# EAGLE design flint_v0.0.1 (EAGLE 7.3.0)
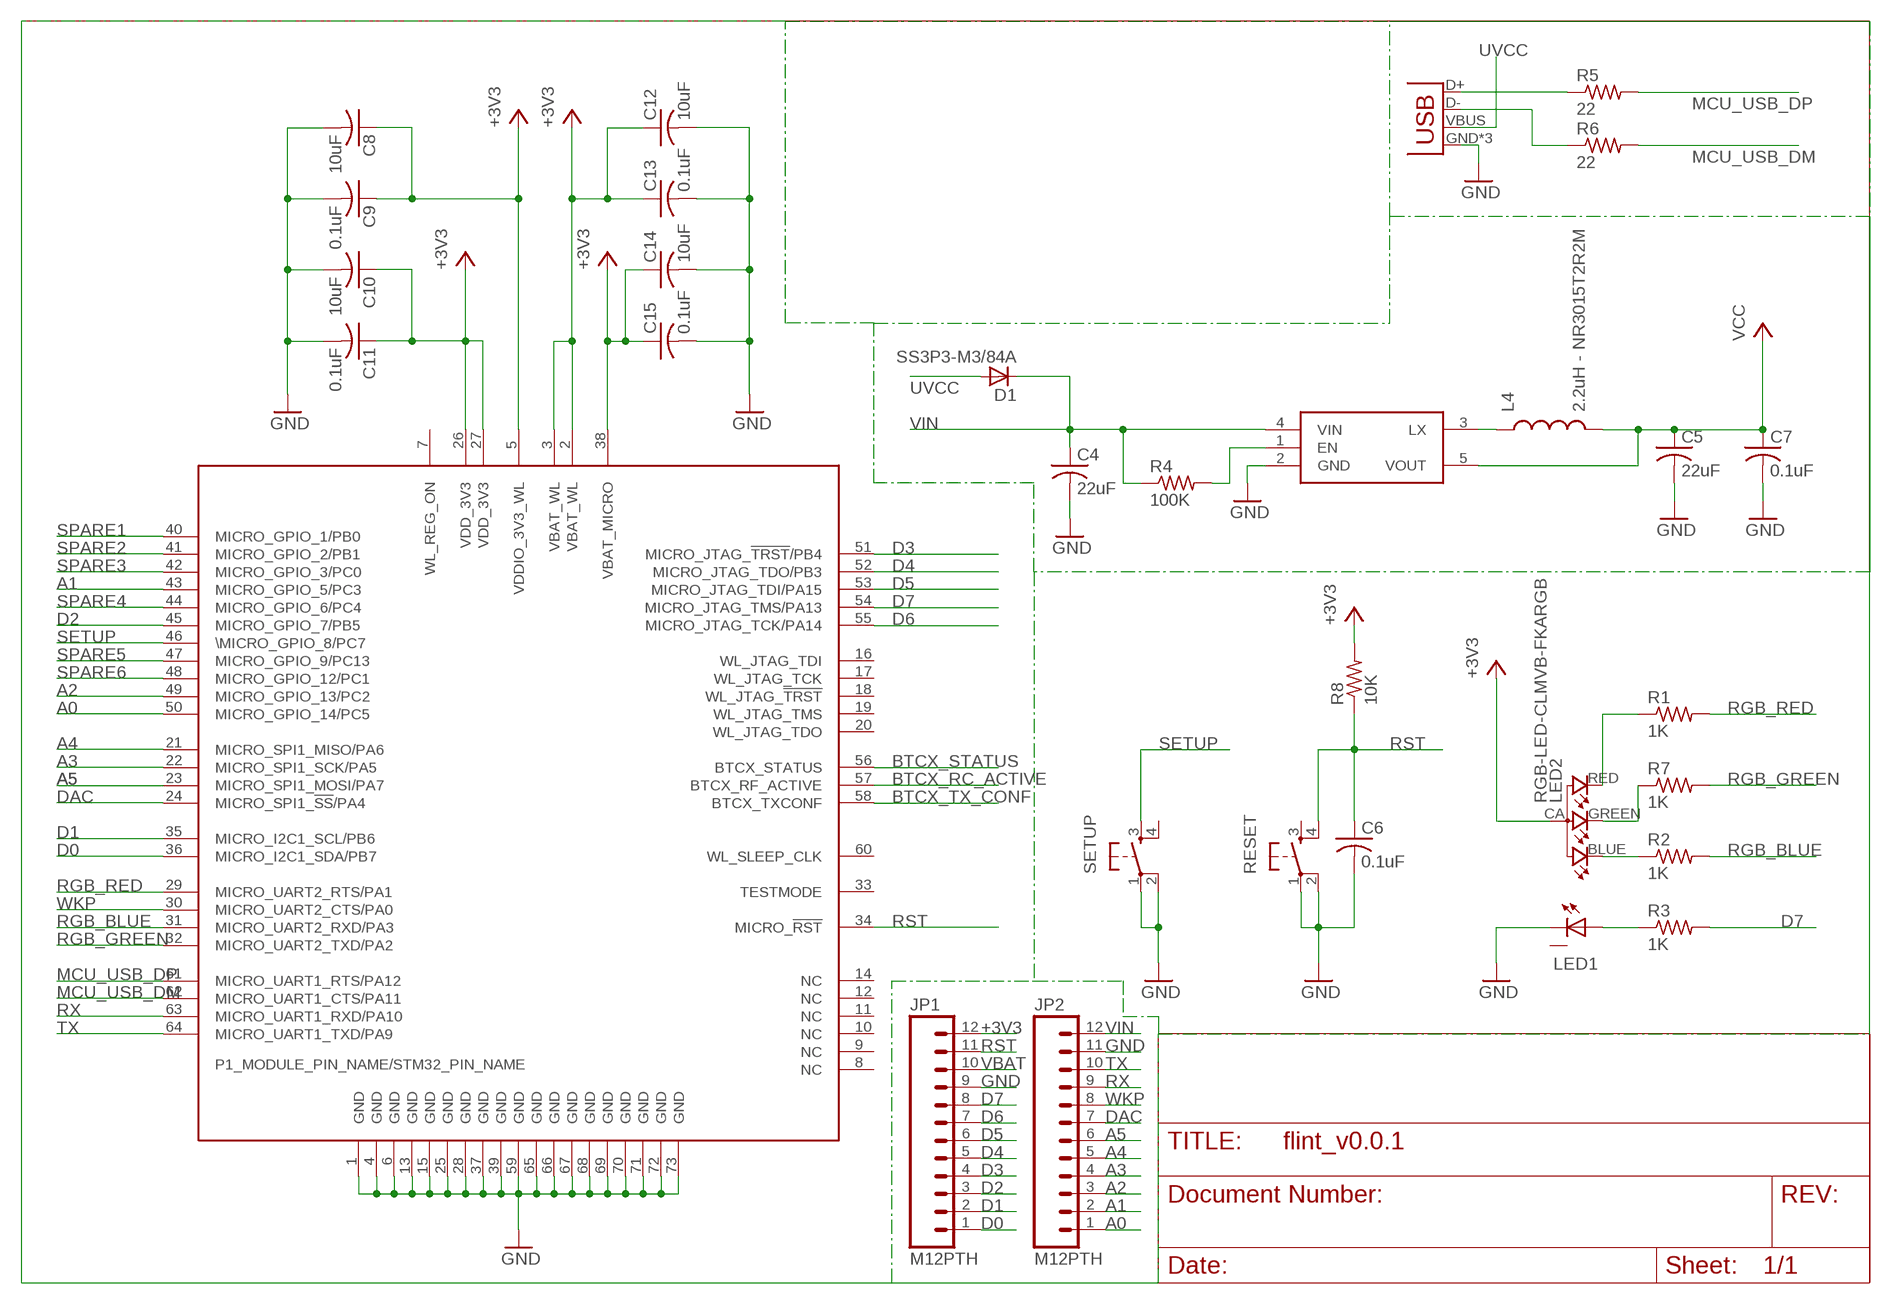
[diagram p0: schematic, sheet 1]

## Parts
C4  22uF  C-US  [C0402_B]
C5  22uF  C-US  [C0402_B]
C6  0.1uF  C-US  [C0402_B]
C7  0.1uF  C-US  [C0402_B]
C8  10uF  C-US  [C0402_B]
C9  0.1uF  C-US  [C0402_B]
C10  10uF  C-US  [C0402_B]
C11  0.1uF  C-US  [C0402_B]
C12  10uF  C-US  [C0402_B]
C13  0.1uF  C-US  [C0402_B]
C14  10uF  C-US  [C0402_B]
C15  0.1uF  C-US  [C0402_B]
D1  SS3P3-M3/84A  BYS10  [SOD106A]
JP1  M12PTH  [1X12-SMALL-PADS]
JP2  M12PTH  [1X12-SMALL-PADS]
JP4  USBUSB-MICROB-SMT-DIP  [USB-MICROB-SMT-DIP]
L4  2.2uH - NR3015T2R2M  INDUCTORB  [INDUCTOR-NR3015]
LED1  BLUE  XLAMP-XPE-THERMAL  [CREE_XLAMP]
LED2  RGB-LED-CLMVB-FKARGB  [PLCC4-2MM-RGB]
R1  1K  R-US_  [R0402_B]
R2  1K  R-US_  [R0402_B]
R3  1K  R-US_  [R0402_B]
R4  100K  R-US_  [R0402_B]
R5  22  R-US_  [R0402_B]
R6  22  R-US_  [R0402_B]
R7  1K  R-US_  [R0402_B]
R8  10K  R-US_  [R0402_B]
RESET  TAC_SWITCHSMD  [TACTILE_SWITCH_SMD]
SETUP  TAC_SWITCHSMD  [TACTILE_SWITCH_SMD]
U$1  WM-N-BM-14  [WM-N-BM-14]
U$2  R8008-33  [SOT23-5]

## Nets
+3V3: C5.1 C7.1 C8.1 C9.1 C10.1 C11.1 C12.1 C13.1 C14.1 C15.1 JP1.12 L4.2 LED2.CA R8.2 U$1.2(VBAT_WL) U$1.3(VBAT_WL) U$1.5(VDDIO_3V3_WL) U$1.26(VDD_3V3) U$1.27(VDD_3V3) U$1.38(VBAT_MICRO) U$2.5(VOUT) ; supply symbol labelled VCC
A0: JP2.1 U$1.50(MICRO_GPIO_14/PC5)
A1: JP2.2 U$1.43(MICRO_GPIO_5/PC3)
A2: JP2.3 U$1.49(MICRO_GPIO_13/PC2)
A3: JP2.4 U$1.22(MICRO_SPI1_SCK/PA5)
A4: JP2.5 U$1.21(MICRO_SPI1_MISO/PA6)
A5: JP2.6 U$1.23(MICRO_SPI1_MOSI/PA7)
BTCX_RC_ACTIVE: U$1.57(BTCX_RF_ACTIVE)
BTCX_STATUS: U$1.56(BTCX_STATUS)
BTCX_TX_CONF: U$1.58(BTCX_TXCONF)
D0: JP1.1 U$1.36(MICRO_I2C1_SDA/PB7)
D1: JP1.2 U$1.35(MICRO_I2C1_SCL/PB6)
D2: JP1.3 U$1.45(MICRO_GPIO_7/PB5)
D3: JP1.4 U$1.51(MICRO_JTAG_!TRST!/PB4)
D4: JP1.5 U$1.52(MICRO_JTAG_TDO/PB3)
D5: JP1.6 U$1.53(MICRO_JTAG_TDI/PA15)
D6: JP1.7 U$1.55(MICRO_JTAG_TCK/PA14)
D7: JP1.8 R3.2 U$1.54(MICRO_JTAG_TMS/PA13)
DAC: JP2.7 U$1.24(MICRO_SPI1_!SS!/PA4)
GND: C4.2 C5.2 C6.2 C7.2 C8.2 C9.2 C10.2 C11.2 C12.2 C13.2 C14.2 C15.2 JP1.9 JP2.11 JP4.GND JP4.MT1(GND) JP4.MT2(GND) LED1.C LED1.C@1(C) RESET.1 RESET.2 SETUP.1 SETUP.2 U$1.1(GND) U$1.4(GND) U$1.6(GND) U$1.13(GND) U$1.15(GND) U$1.25(GND) U$1.28(GND) U$1.37(GND) U$1.39(GND) U$1.59(GND) U$1.65(GND) U$1.66(GND) U$1.67(GND) U$1.68(GND) U$1.69(GND) U$1.70(GND) U$1.71(GND) U$1.72(GND) U$1.73(GND) U$2.2(GND)
MCU_USB_DM: R6.2 U$1.62(MICRO_UART1_CTS/PA11)
MCU_USB_DP: R5.2 U$1.61(MICRO_UART1_RTS/PA12)
N$1: JP4.D+ R5.1
N$3: JP4.D- R6.1
N$5: R4.2 U$2.1(EN)
N$6: LED2.BLUE R2.1
N$7: L4.1 U$2.3(LX)
N$8: LED2.RED R1.1
N$10: LED2.GREEN R7.1
N$11: LED1.A LED1.A@1(A) R3.1
RGB_BLUE: R2.2 U$1.31(MICRO_UART2_RXD/PA3)
RGB_GREEN: R7.2 U$1.32(MICRO_UART2_TXD/PA2)
RGB_RED: R1.2 U$1.29(MICRO_UART2_RTS/PA1)
RST: C6.1 JP1.11 R8.1 RESET.4 U$1.34(MICRO_!RST!)
RX: JP2.9 U$1.63(MICRO_UART1_RXD/PA10)
SETUP: SETUP.3 U$1.46(\MICRO_GPIO_8/PC7)
SPARE1: U$1.40(MICRO_GPIO_1/PB0)
SPARE2: U$1.41(MICRO_GPIO_2/PB1)
SPARE3: U$1.42(MICRO_GPIO_3/PC0)
SPARE4: U$1.44(MICRO_GPIO_6/PC4)
SPARE5: U$1.47(MICRO_GPIO_9/PC13)
SPARE6: U$1.48(MICRO_GPIO_12/PC1)
TX: JP2.10 U$1.64(MICRO_UART1_TXD/PA9)
UVCC: D1.A JP4.VBUS
VBAT: JP1.10
VIN: C4.1 D1.K JP2.12 R4.1 U$2.4(VIN)
WKP: JP2.8 U$1.30(MICRO_UART2_CTS/PA0)
Unconnected: LED1.X(T) RESET.3 SETUP.4 U$1.7(WL_REG_ON) U$1.8(NC) U$1.9(NC) U$1.10(NC) U$1.11(NC) U$1.12(NC) U$1.14(NC) U$1.16(WL_JTAG_TDI) U$1.17(WL_JTAG_TCK) U$1.18(WL_JTAG_!TRST!) U$1.19(WL_JTAG_TMS) U$1.20(WL_JTAG_TDO) U$1.33(TESTMODE) U$1.60(WL_SLEEP_CLK)

## Library data of the parts
C4-C15 = Spark:C-US: Capacitor
D1 = telefunken:BYS10: DIODE; MPN: BYS10/45; OC_FARNELL: 9549188; OC_NEWARK: 96K7236
JP1 JP2 = Spark:M12: Header 12 Standard 12-pin 0.1" header. Use with straight break away headers (SKU : PRT-00116), right angle break away headers (PRT-00553), swiss pins (PRT-00743), machine pins (PRT-00117), and female headers (PRT-00115).
JP4 = Spark:USB
L4 = Spark:INDUCTOR
LED1 = Spark:XLAMP-XPE-THERMAL
LED2 = Spark:RGB-LED-CLMVB-FKA: CREE CLMVB-FKA RGB LED 2mm x 2mm
R1-R8 = Spark:R-US_: 0402 Resistor
RESET SETUP = Spark:TAC_SWITCH: SMD Tactiile Switch
U$1 = Spark:WM-N-BM-14
U$2 = Spark:R8008-33

## Board
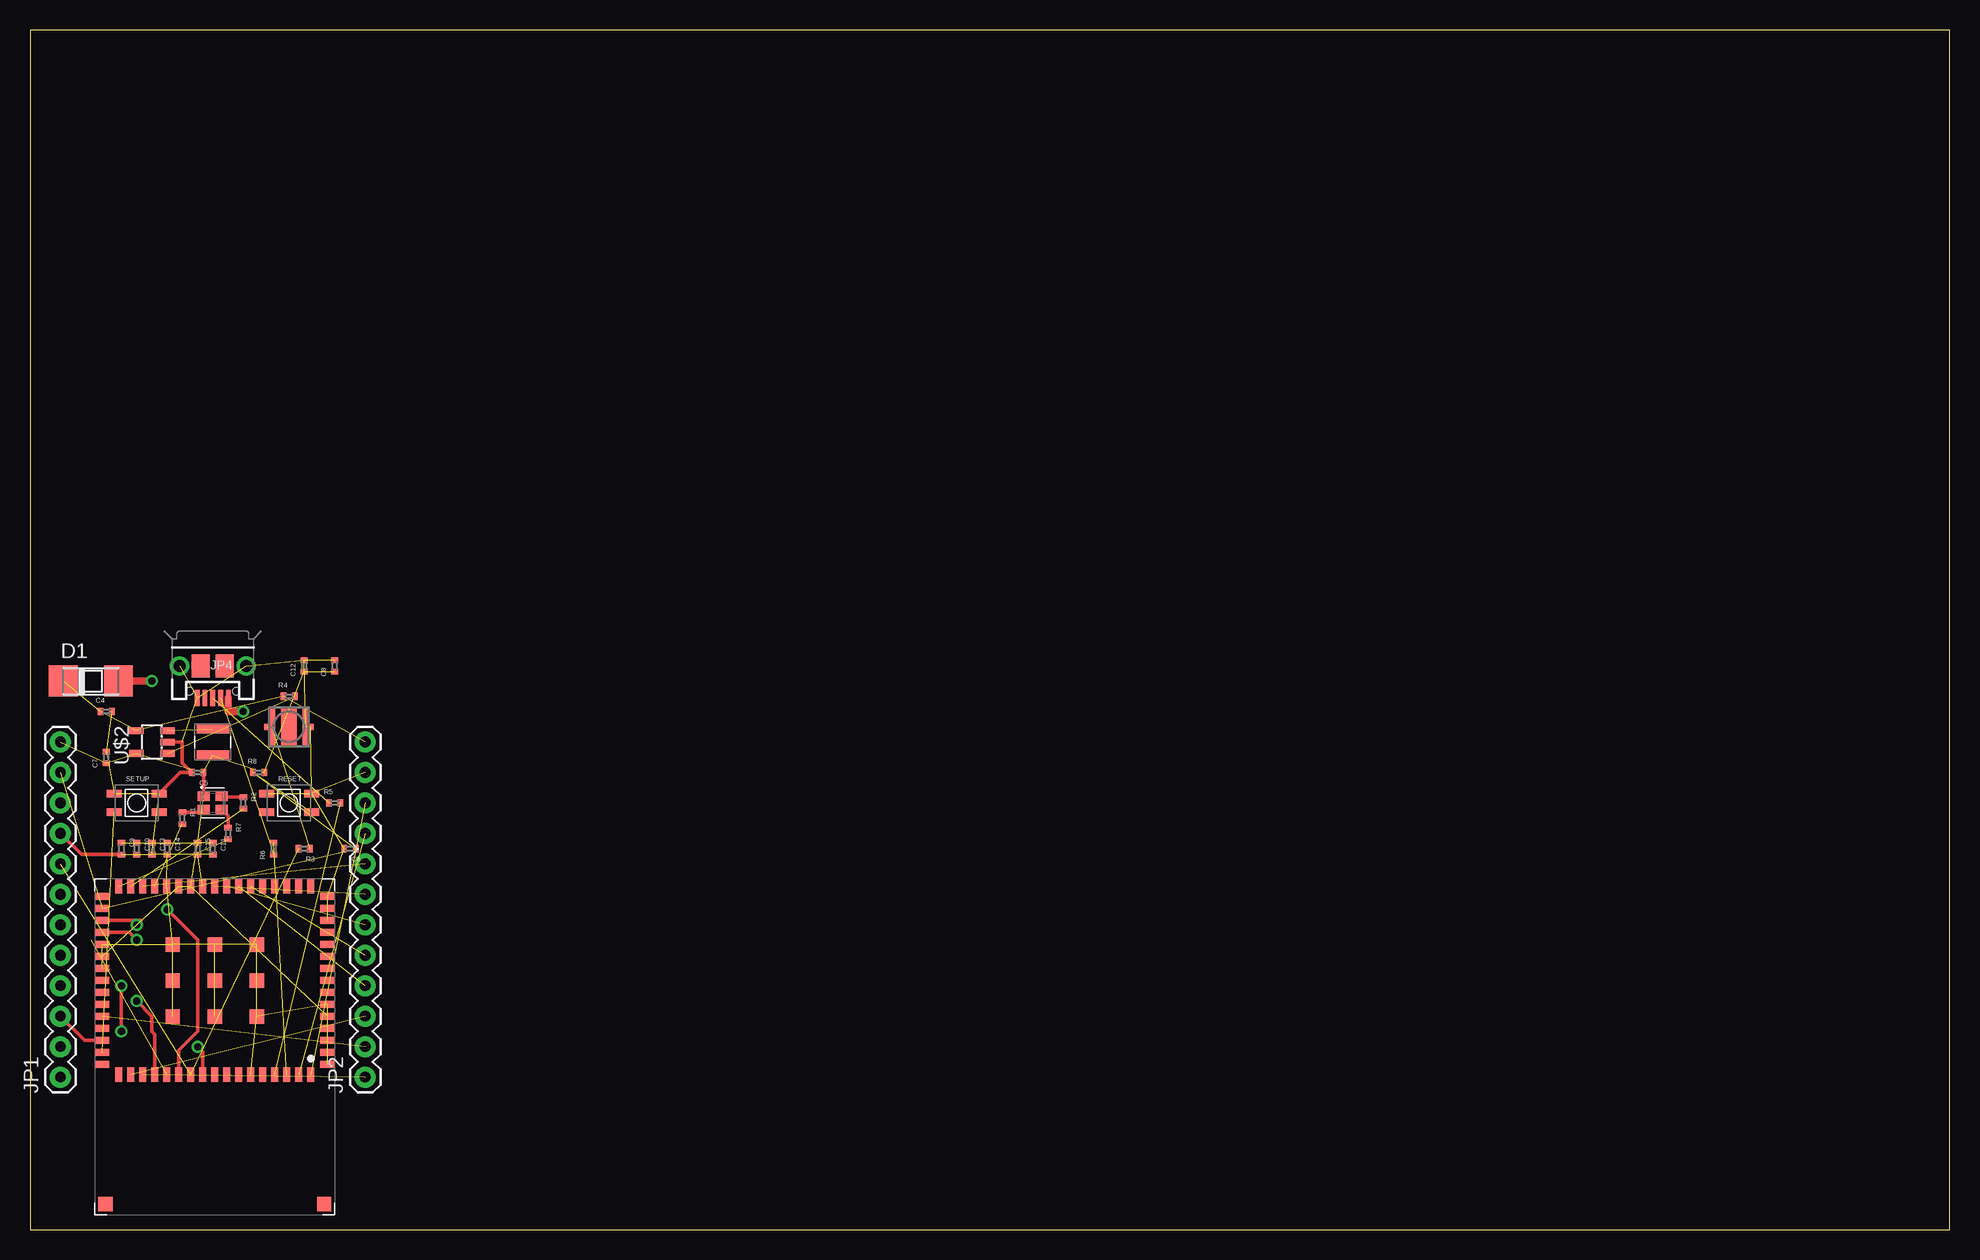
[diagram p1: board, top side]
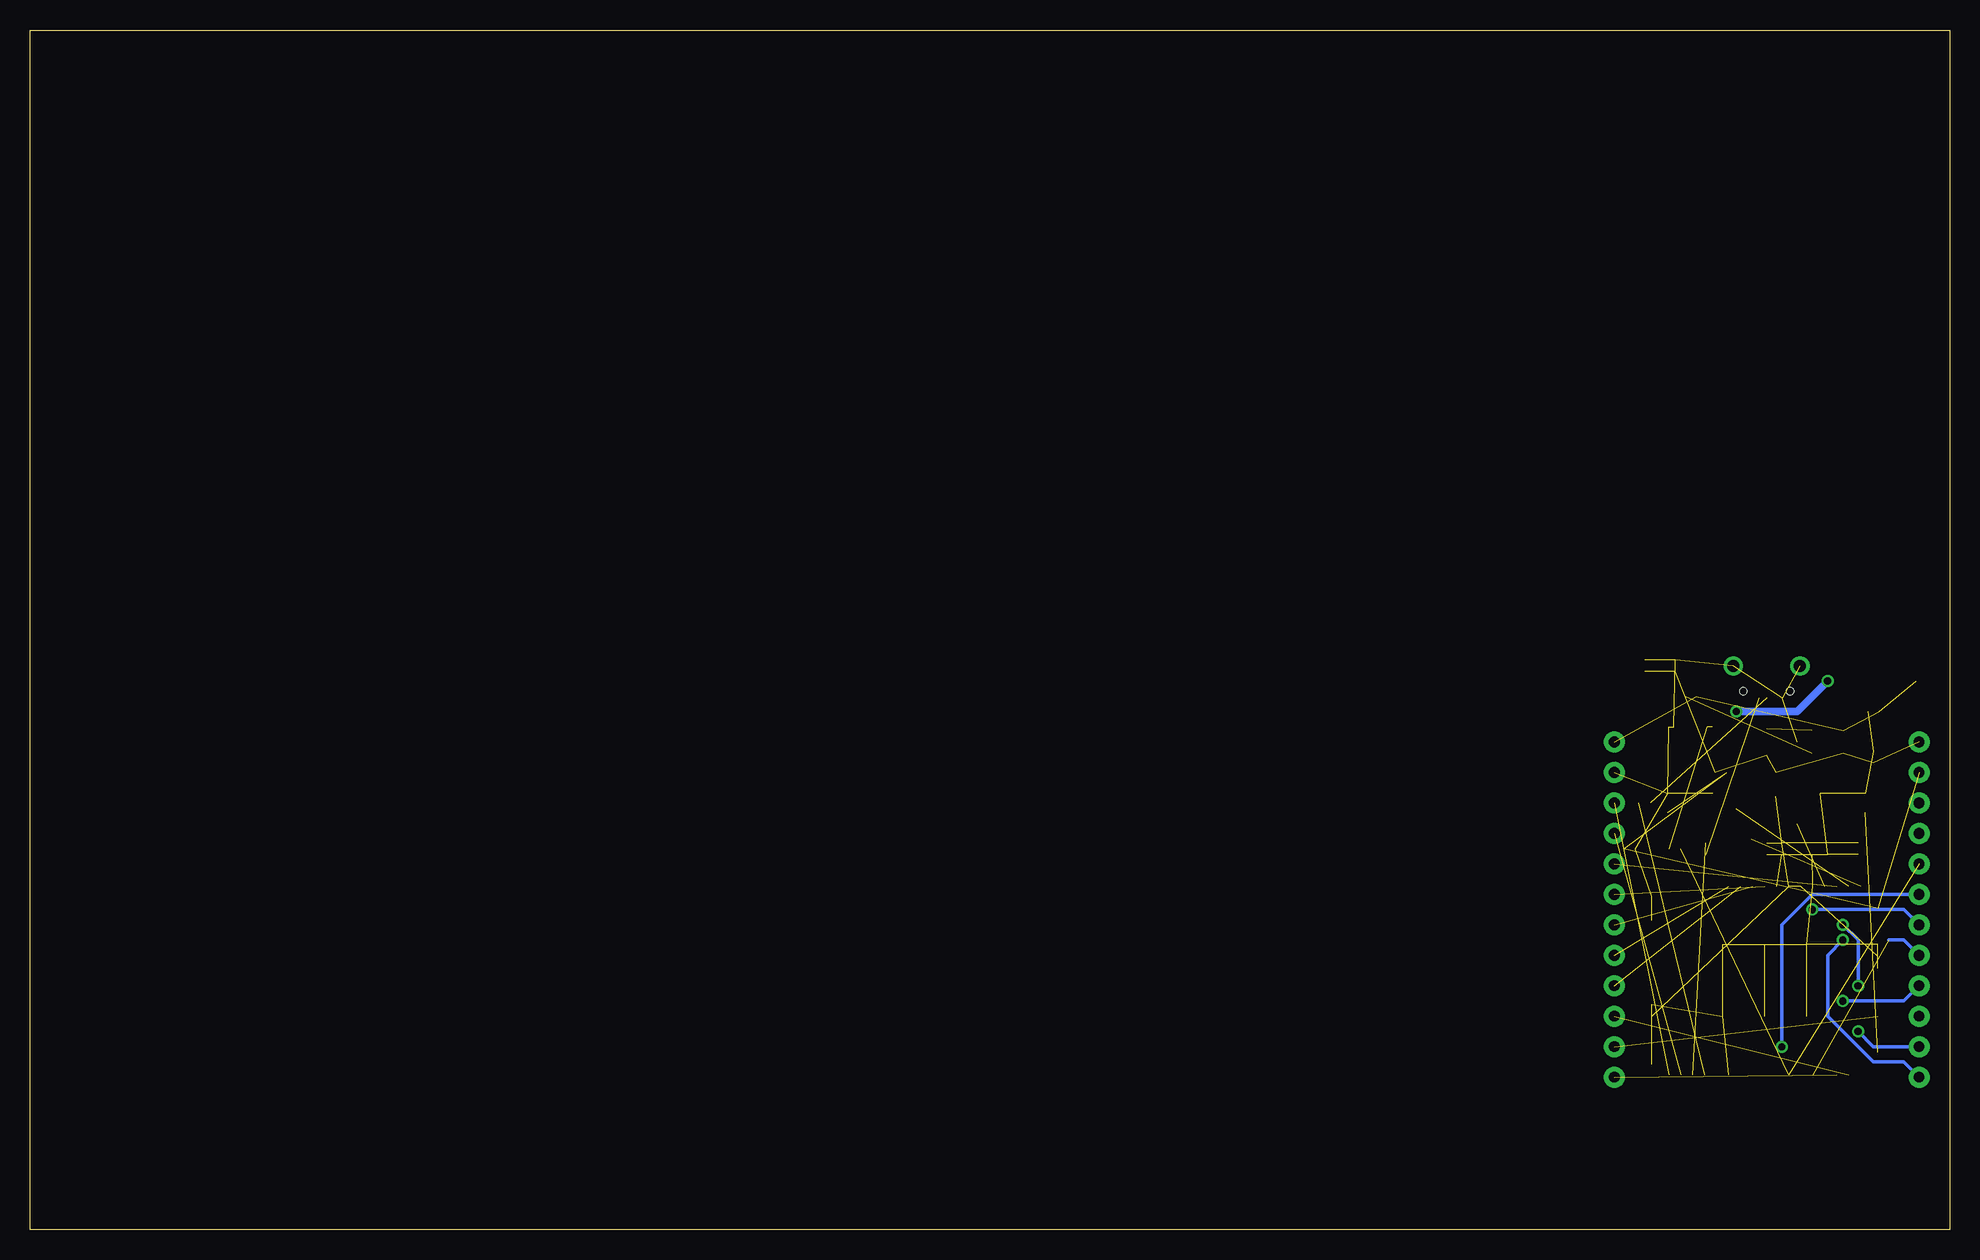
[diagram p2: board, bottom side, seen from below]

Size 160 x 100 mm. Coordinates in mm from the lower left corner, seen from the top.
Outline: 0,0 160,0 160,100 0,100 0,0
Copper layers (1*16): Top 0.035mm / dielectric 1.5mm / Bottom 0.035mm
Design rules "default": minimum track width 10mil, minimum drill 24mil, track to track 8mil, track to pad 8mil, pad to pad 8mil, via to via 8mil, smd to smd 8mil, copper to edge 40mil, drill to drill 8mil, minimum pad ring 10mil, minimum via ring 8mil, stop-mask expansion 4mil, vias tented up to drill 0mil, thermal gap 10mil

### Footprints (pad centres in the part's own frame; a part is rotated, then mirrored left to right if it is on the bottom)
C0402_B = smd 0.457 x 0.61: 1 -0.483,0; 2 0.483,0
SOD106A = smd 2.4 x 2.6: A 2.3,0; K -2.3,0
1X12-SMALL-PADS = drill 0.889 pad 1.753: 1 0,0; 2 2.54,0; 3 5.08,0; 4 7.62,0; 5 10.16,0; 6 12.7,0; 7 15.24,0; 8 17.78,0; 9 20.32,0; 10 22.86,0; 11 25.4,0; 12 27.94,0
USB-MICROB-SMT-DIP = smd 0.4 x 1.35: D+ 0,2.675; D- -0.65,2.675; GND 1.3,2.675; ID 0.65,2.675; VBUS -1.3,2.675 | drill 1 pad 1.6: MT1 -2.775,0; MT2 2.775,0 | smd 1.5 x 1.9: P$1 -1,0; P$2 1,0.01 | hole 0.6: -1.95,2.1; 1.95,2.1
INDUCTOR-NR3015 = smd 0.8 x 2.7: 1 -1.1,0; 2 1.1,0
CREE_XLAMP = smd 0.5 x 3.3: A -1.4,0; C 1.4,0 | smd 0.45 x 0.5: A@1 -1.825,0; C@1 1.825,0 | smd 1.3 x 3.3: X 0,0
PLCC4-2MM-RGB = smd 1 x 0.8: BLUE -0.75,-0.55; CA 0.75,-0.55; GREEN -0.75,0.55; RED 0.75,0.55
R0402_B = smd 0.457 x 0.61: 1 -0.483,0; 2 0.483,0
TACTILE_SWITCH_SMD = smd 1.25 x 0.65: 1 -1.875,0.775; 2 1.875,0.775; 3 -1.875,-0.775; 4 1.875,-0.775
WM-N-BM-14 = smd 1.2 x 0.6: 1 0.6,15.45; 2 0.6,14.45; 3 0.6,13.45; 4 0.6,12.45; 5 0.6,11.45; 6 0.6,10.45; 7 0.6,9.45; 8 0.6,8.45; 9 0.6,7.45; 10 0.6,6.45; 11 0.6,5.45; 12 0.6,4.45; 13 0.6,3.45; 14 0.6,2.45; 15 0.6,1.45; 33 19.4,1.45; 34 19.4,2.45; 35 19.4,3.45; 36 19.4,4.45; 37 19.4,5.45; 38 19.4,6.45; 39 19.4,7.45; 40 19.4,8.45; 41 19.4,9.45; 42 19.4,10.45; 43 19.4,11.45; 44 19.4,12.45; 45 19.4,13.45; 46 19.4,14.45; 47 19.4,15.45 | smd 0.6 x 1.2: 16 2,0.6; 17 3,0.6; 18 4,0.6; 19 5,0.6; 20 6,0.6; 21 7,0.6; 22 8,0.6; 23 9,0.6; 24 10,0.6; 25 11,0.6; 26 12,0.6; 27 13,0.6; 28 14,0.6; 29 15,0.6; 30 16,0.6; 31 17,0.6; 32 18,0.6; 48 18,16.3; 49 17,16.3; 50 16,16.3; 51 15,16.3; 52 14,16.3; 53 13,16.3; 54 12,16.3; 55 11,16.3; 56 10,16.3; 57 9,16.3; 58 8,16.3; 59 7,16.3; 60 6,16.3; 61 5,16.3; 62 4,16.3; 63 3,16.3; 64 2,16.3 | smd 1.2 x 1.2: 65 6.5,11.45; 66 6.5,8.45; 67 6.5,5.45; 68 10,11.45; 69 10,8.45; 70 10,5.45; 71 13.5,11.45; 72 13.5,8.45; 73 13.5,5.45; 74 19.12,27.07; 75 0.88,27.07
SOT23-5 = smd 0.55 x 1.2: 1 -0.95,-1.3; 2 0,-1.3; 3 0.95,-1.3; 4 0.95,1.3; 5 -0.95,1.3

### Placement (x,y rotation side)
C4  6.35,43.18 0 top
C5  13.97,38.1 180 top
C6  26.67,31.75 180 top
C7  6.35,39.37 90 top
C8  25.4,46.99 90 top
C9  7.62,31.75 270 top
C10  8.89,31.75 270 top
C11  15.24,31.75 270 top
C12  22.86,46.99 90 top
C13  10.16,31.75 270 top
C14  11.43,31.75 270 top
C15  13.97,31.75 270 top
D1  5.08,45.72 0 top
JP1  2.54,12.7 90 top
JP2  27.94,12.7 90 top
JP4  15.24,46.99 180 top
L4  15.24,40.64 270 top
LED1  21.59,41.91 0 top
LED2  15.24,35.56 180 top
R1  12.7,34.29 270 top
R2  17.78,35.56 270 top
R3  22.86,31.75 180 top
R4  21.59,44.45 0 top
R5  25.4,35.56 0 top
R6  20.32,31.75 90 top
R7  16.51,33.02 270 top
R8  19.05,38.1 0 top
RESET  21.59,35.56 0 top
SETUP  8.89,35.56 0 top
U$1  25.4,29.21 180 top
U$2  10.16,40.64 90 top

### Tracks (layer width: path | path; a pad name or v marks a point on that pad's centre or on a via)
+3V3  (19 unrouted)
  Top 0.305: LED2.CA 14.49,38.06 C5.1
A0  (1 unrouted)
A1  (1 unrouted)
A2  (1 unrouted)
A3  (1 unrouted)
A4  (1 unrouted)
A5  (1 unrouted)
D0  (via drill 0.6)
  Top 0.305: v8.89,24.13 8.26,24.76 U$1.36
  Bottom 0.305: JP1.1 3.81,13.97 6.35,13.97 10.16,17.78 10.16,22.86 v8.89,24.13
D1  (via drill 0.6)
  Top 0.305: v8.89,25.4 9.25,25.76 U$1.35 | v7.62,16.51 v7.62,20.32
  Bottom 0.305: JP1.2 6.35,15.24 v7.62,16.51 | v8.89,25.4 7.62,24.13 v7.62,20.32
D2
  Top 0.305: U$1.45 4.56,15.76 JP1.3
D3  (via drill 0.6)
  Top 0.305: v8.89,19.05 10.16,17.78 10.16,16.51 10.4,16.27 U$1.51
  Bottom 0.305: JP1.4 3.81,19.05 v8.89,19.05
D4  (1 unrouted)
  Bottom 0.305: JP1.5 3.81,24.13 5.08,24.13
D5  (via drill 0.6)
  Top 0.305: v11.43,26.67 13.97,24.13 13.97,16.51 12.4,14.94 U$1.53
  Bottom 0.305: JP1.6 3.81,26.67 v11.43,26.67
D6  (via drill 0.6)
  Top 0.305: v13.97,15.24 14.4,14.81 U$1.55
  Bottom 0.305: JP1.7 11.43,27.94 13.97,25.4 v13.97,15.24
D7  (2 unrouted)
DAC  (1 unrouted)
GND  (39 unrouted)
  Top 0.305: SETUP.2 12.53,38.1 C5.2 12.7,38.89 12.7,40.64 U$2.2 | JP1.9 4.29,31.27 C9.2
MCU_USB_DM  (1 unrouted)
MCU_USB_DP  (1 unrouted)
N$1  (1 unrouted)
N$3  (1 unrouted)
N$5  (1 unrouted)
N$6
  Top 0.305: R2.1 16.06,36.04 LED2.BLUE
N$7  (1 unrouted)
N$8
  Top 0.305: R1.1 14.25,34.77 LED2.RED
N$10
  Top 0.305: R7.1 16.51,34.49 LED2.GREEN
N$11  (2 unrouted)
RGB_BLUE  (1 unrouted)
RGB_GREEN  (1 unrouted)
RGB_RED  (1 unrouted)
RST  (4 unrouted)
RX  (1 unrouted)
SETUP  (1 unrouted)
TX  (1 unrouted)
UVCC  (via drill 0.6)
  Top 0.305: JP4.VBUS 16.54,44.42 16.51,44.45
  Top 0.61: D1.A v10.16,45.72 | v17.78,43.18 16.51,43.18 16.51,44.28 JP4.VBUS
  Bottom 0.61: v10.16,45.72 12.7,43.18 v17.78,43.18
VIN  (4 unrouted)
WKP  (1 unrouted)